# Altium schematic sheet DESIGN _FINAL.SchDoc
size A; SheetNumber: 1; SheetTotal: 3
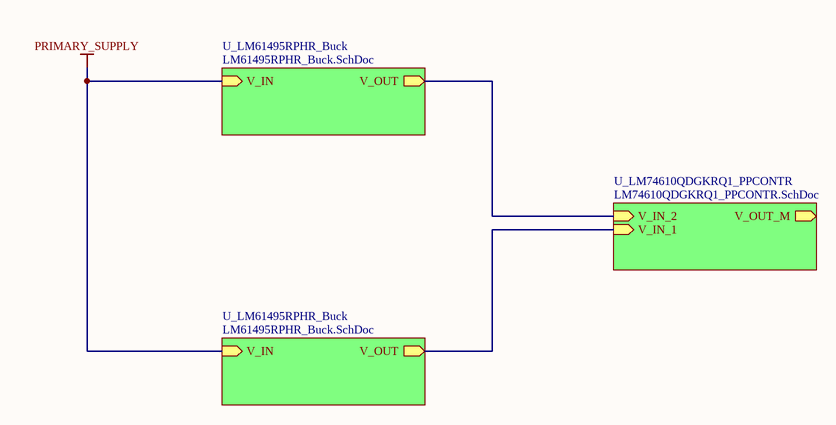
[diagram p0: DESIGN _FINAL.SchDoc]

## Sub-sheets
U_LM61495RPHR_Buck = LM61495RPHR_Buck.SchDoc: V_IN (in), V_OUT (out)
U_LM61495RPHR_Buck = LM61495RPHR_Buck.SchDoc: V_IN (in), V_OUT (out)
U_LM74610QDGKRQ1_PPCONTR = LM74610QDGKRQ1_PPCONTR.SchDoc: V_OUT_M (out), V_IN_2 (in), V_IN_1 (in)

## Nets
PRIMARY_SUPPLY: sheet U_LM61495RPHR_Buck/V_IN, sheet U_LM61495RPHR_Buck/V_IN
(unnamed): sheet U_LM61495RPHR_Buck/V_OUT, sheet U_LM74610QDGKRQ1_PPCONTR/V_IN_2
(unnamed): sheet U_LM61495RPHR_Buck/V_OUT, sheet U_LM74610QDGKRQ1_PPCONTR/V_IN_1